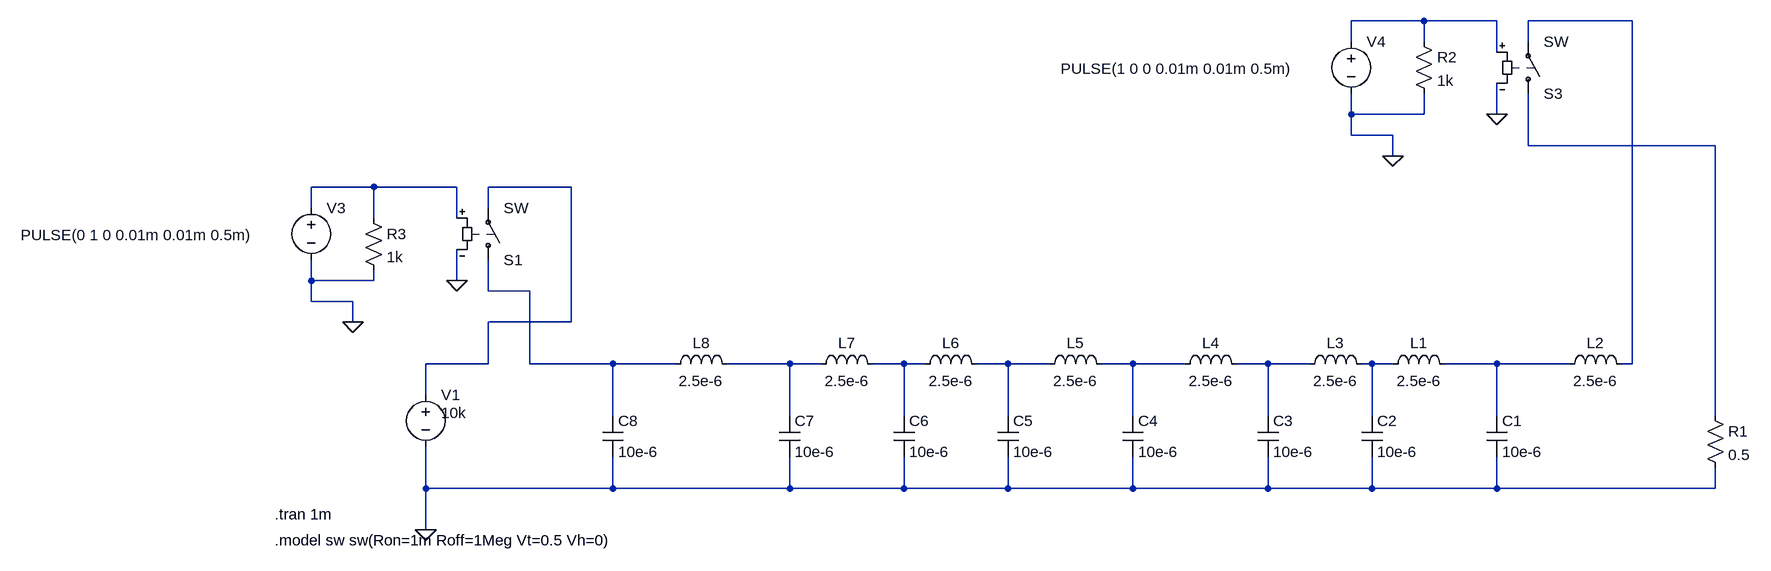
[diagram p0: schematic PFN_with_switch v2.asc]
PFN_with_switch v2.asc, the LTspice schematic file:
Version 4
SHEET 1 1516 680
WIRE 816 -896 704 -896
WIRE 928 -896 816 -896
WIRE 1136 -896 976 -896
WIRE 704 -864 704 -896
WIRE 816 -864 816 -896
WIRE 976 -864 976 -896
WIRE 928 -848 928 -896
WIRE 704 -752 704 -784
WIRE 816 -752 816 -784
WIRE 816 -752 704 -752
WIRE 928 -752 928 -800
WIRE 704 -720 704 -752
WIRE 768 -720 704 -720
WIRE 976 -704 976 -784
WIRE 1264 -704 976 -704
WIRE 768 -688 768 -720
WIRE -800 -640 -896 -640
WIRE -672 -640 -800 -640
WIRE -496 -640 -624 -640
WIRE -896 -608 -896 -640
WIRE -624 -608 -624 -640
WIRE -800 -592 -800 -640
WIRE -672 -592 -672 -640
WIRE -896 -496 -896 -528
WIRE -800 -496 -800 -512
WIRE -800 -496 -896 -496
WIRE -672 -496 -672 -544
WIRE -624 -480 -624 -528
WIRE -560 -480 -624 -480
WIRE -896 -464 -896 -496
WIRE -832 -464 -896 -464
WIRE -832 -432 -832 -464
WIRE -496 -432 -496 -640
WIRE -496 -432 -624 -432
WIRE -624 -368 -624 -432
WIRE -624 -368 -720 -368
WIRE -560 -368 -560 -480
WIRE -432 -368 -560 -368
WIRE -336 -368 -432 -368
WIRE -160 -368 -256 -368
WIRE -112 -368 -160 -368
WIRE 16 -368 -32 -368
WIRE 48 -368 16 -368
WIRE 176 -368 128 -368
WIRE 240 -368 176 -368
WIRE 368 -368 320 -368
WIRE 448 -368 368 -368
WIRE 576 -368 528 -368
WIRE 640 -368 576 -368
WIRE 736 -368 720 -368
WIRE 768 -368 736 -368
WIRE 928 -368 848 -368
WIRE 1040 -368 928 -368
WIRE 1136 -368 1136 -896
WIRE 1136 -368 1120 -368
WIRE -720 -320 -720 -368
WIRE -432 -288 -432 -368
WIRE -160 -288 -160 -368
WIRE 16 -288 16 -368
WIRE 176 -288 176 -368
WIRE 368 -288 368 -368
WIRE 576 -288 576 -368
WIRE 736 -288 736 -368
WIRE 928 -288 928 -368
WIRE 1264 -288 1264 -704
WIRE -720 -176 -720 -240
WIRE -432 -176 -432 -224
WIRE -432 -176 -720 -176
WIRE -160 -176 -160 -224
WIRE -160 -176 -432 -176
WIRE 16 -176 16 -224
WIRE 16 -176 -160 -176
WIRE 176 -176 176 -224
WIRE 176 -176 16 -176
WIRE 368 -176 368 -224
WIRE 368 -176 176 -176
WIRE 576 -176 576 -224
WIRE 576 -176 368 -176
WIRE 736 -176 736 -224
WIRE 736 -176 576 -176
WIRE 928 -176 928 -224
WIRE 928 -176 736 -176
WIRE 1264 -176 1264 -208
WIRE 1264 -176 928 -176
WIRE -720 -112 -720 -176
FLAG -720 -112 0
FLAG -832 -432 0
FLAG 768 -688 0
FLAG -672 -496 0
FLAG 928 -752 0
DATAFLAG 1120 -176 ""
SYMBOL voltage -720 -336 R0
WINDOW 3 24 44 Left 2
WINDOW 123 0 0 Left 0
WINDOW 39 0 0 Left 0
SYMATTR Value 10k
SYMATTR InstName V1
SYMBOL ind 752 -352 R270
WINDOW 0 32 56 VTop 2
WINDOW 3 5 56 VBottom 2
SYMATTR InstName L1
SYMATTR Value 2.5e-6
SYMBOL cap 912 -288 R0
SYMATTR InstName C1
SYMATTR Value 10e-6
SYMATTR SpiceLine IC=0
SYMBOL res 1248 -304 R0
SYMATTR InstName R1
SYMATTR Value 0.5
SYMBOL ind 1024 -352 R270
WINDOW 0 32 56 VTop 2
WINDOW 3 5 56 VBottom 2
SYMATTR InstName L2
SYMATTR Value 2.5e-6
SYMBOL ind 624 -352 R270
WINDOW 0 32 56 VTop 2
WINDOW 3 5 56 VBottom 2
SYMATTR InstName L3
SYMATTR Value 2.5e-6
SYMBOL cap 720 -288 R0
SYMATTR InstName C2
SYMATTR Value 10e-6
SYMATTR SpiceLine IC=0
SYMBOL ind 432 -352 R270
WINDOW 0 32 56 VTop 2
WINDOW 3 5 56 VBottom 2
SYMATTR InstName L4
SYMATTR Value 2.5e-6
SYMBOL ind 224 -352 R270
WINDOW 0 32 56 VTop 2
WINDOW 3 5 56 VBottom 2
SYMATTR InstName L5
SYMATTR Value 2.5e-6
SYMBOL cap 560 -288 R0
SYMATTR InstName C3
SYMATTR Value 10e-6
SYMATTR SpiceLine IC=0
SYMBOL cap 352 -288 R0
SYMATTR InstName C4
SYMATTR Value 10e-6
SYMATTR SpiceLine IC=0
SYMBOL ind 32 -352 R270
WINDOW 0 32 56 VTop 2
WINDOW 3 5 56 VBottom 2
SYMATTR InstName L6
SYMATTR Value 2.5e-6
SYMBOL ind -128 -352 R270
WINDOW 0 32 56 VTop 2
WINDOW 3 5 56 VBottom 2
SYMATTR InstName L7
SYMATTR Value 2.5e-6
SYMBOL ind -352 -352 R270
WINDOW 0 32 56 VTop 2
WINDOW 3 5 56 VBottom 2
SYMATTR InstName L8
SYMATTR Value 2.5e-6
SYMBOL cap 160 -288 R0
SYMATTR InstName C5
SYMATTR Value 10e-6
SYMATTR SpiceLine IC=0
SYMBOL cap 0 -288 R0
SYMATTR InstName C6
SYMATTR Value 10e-6
SYMATTR SpiceLine IC=0
SYMBOL cap -176 -288 R0
SYMATTR InstName C7
SYMATTR Value 10e-6
SYMATTR SpiceLine IC=0
SYMBOL cap -448 -288 R0
SYMATTR InstName C8
SYMATTR Value 10e-6
SYMATTR SpiceLine IC=0
SYMBOL voltage -896 -624 R0
WINDOW 3 -447 58 Left 2
WINDOW 123 0 0 Left 0
WINDOW 39 0 0 Left 0
SYMATTR Value PULSE(0 1 0 0.01m 0.01m 0.5m)
SYMATTR InstName V3
SYMBOL sw -624 -512 M180
SYMATTR InstName S1
SYMBOL voltage 704 -880 R0
WINDOW 3 -447 58 Left 2
WINDOW 123 0 0 Left 0
WINDOW 39 0 0 Left 0
SYMATTR Value PULSE(1 0 0 0.01m 0.01m 0.5m)
SYMATTR InstName V4
SYMBOL sw 976 -768 M180
SYMATTR InstName S3
SYMBOL res 800 -880 R0
SYMATTR InstName R2
SYMATTR Value 1k
SYMBOL res -816 -608 R0
SYMATTR InstName R3
SYMATTR Value 1k
TEXT -952 -136 Left 2 !.tran 1m
TEXT -952 -96 Left 2 !.model sw sw(Ron=1m Roff=1Meg Vt=0.5 Vh=0)

The netlist it stands for:
* PFN_with_switch v2.asc
V1 N005 0 10k
L1 N012 N013 2.5e-6
C1 N013 0 10e-6 IC=0
R1 N003 0 0.5
L2 N013 N002 2.5e-6
L3 N011 N012 2.5e-6
C2 N012 0 10e-6 IC=0
L4 N010 N011 2.5e-6
L5 N009 N010 2.5e-6
C3 N011 0 10e-6 IC=0
C4 N010 0 10e-6 IC=0
L6 N008 N009 2.5e-6
L7 N007 N008 2.5e-6
L8 N006 N007 2.5e-6
C5 N009 0 10e-6 IC=0
C6 N008 0 10e-6 IC=0
C7 N007 0 10e-6 IC=0
C8 N006 0 10e-6 IC=0
V3 N004 0 PULSE(0 1 0 0.01m 0.01m 0.5m)
S1 N006 N005 N004 0 SW
V4 N001 0 PULSE(1 0 0 0.01m 0.01m 0.5m)
S3 N003 N002 N001 0 SW
R2 N001 0 1k
R3 N004 0 1k
.tran 1m
.model sw sw(Ron=1m Roff=1Meg Vt=0.5 Vh=0)
.backanno
.end